# EAGLE design SparkFun_ZOE-M8Q GPS (EAGLE 9.6.2)
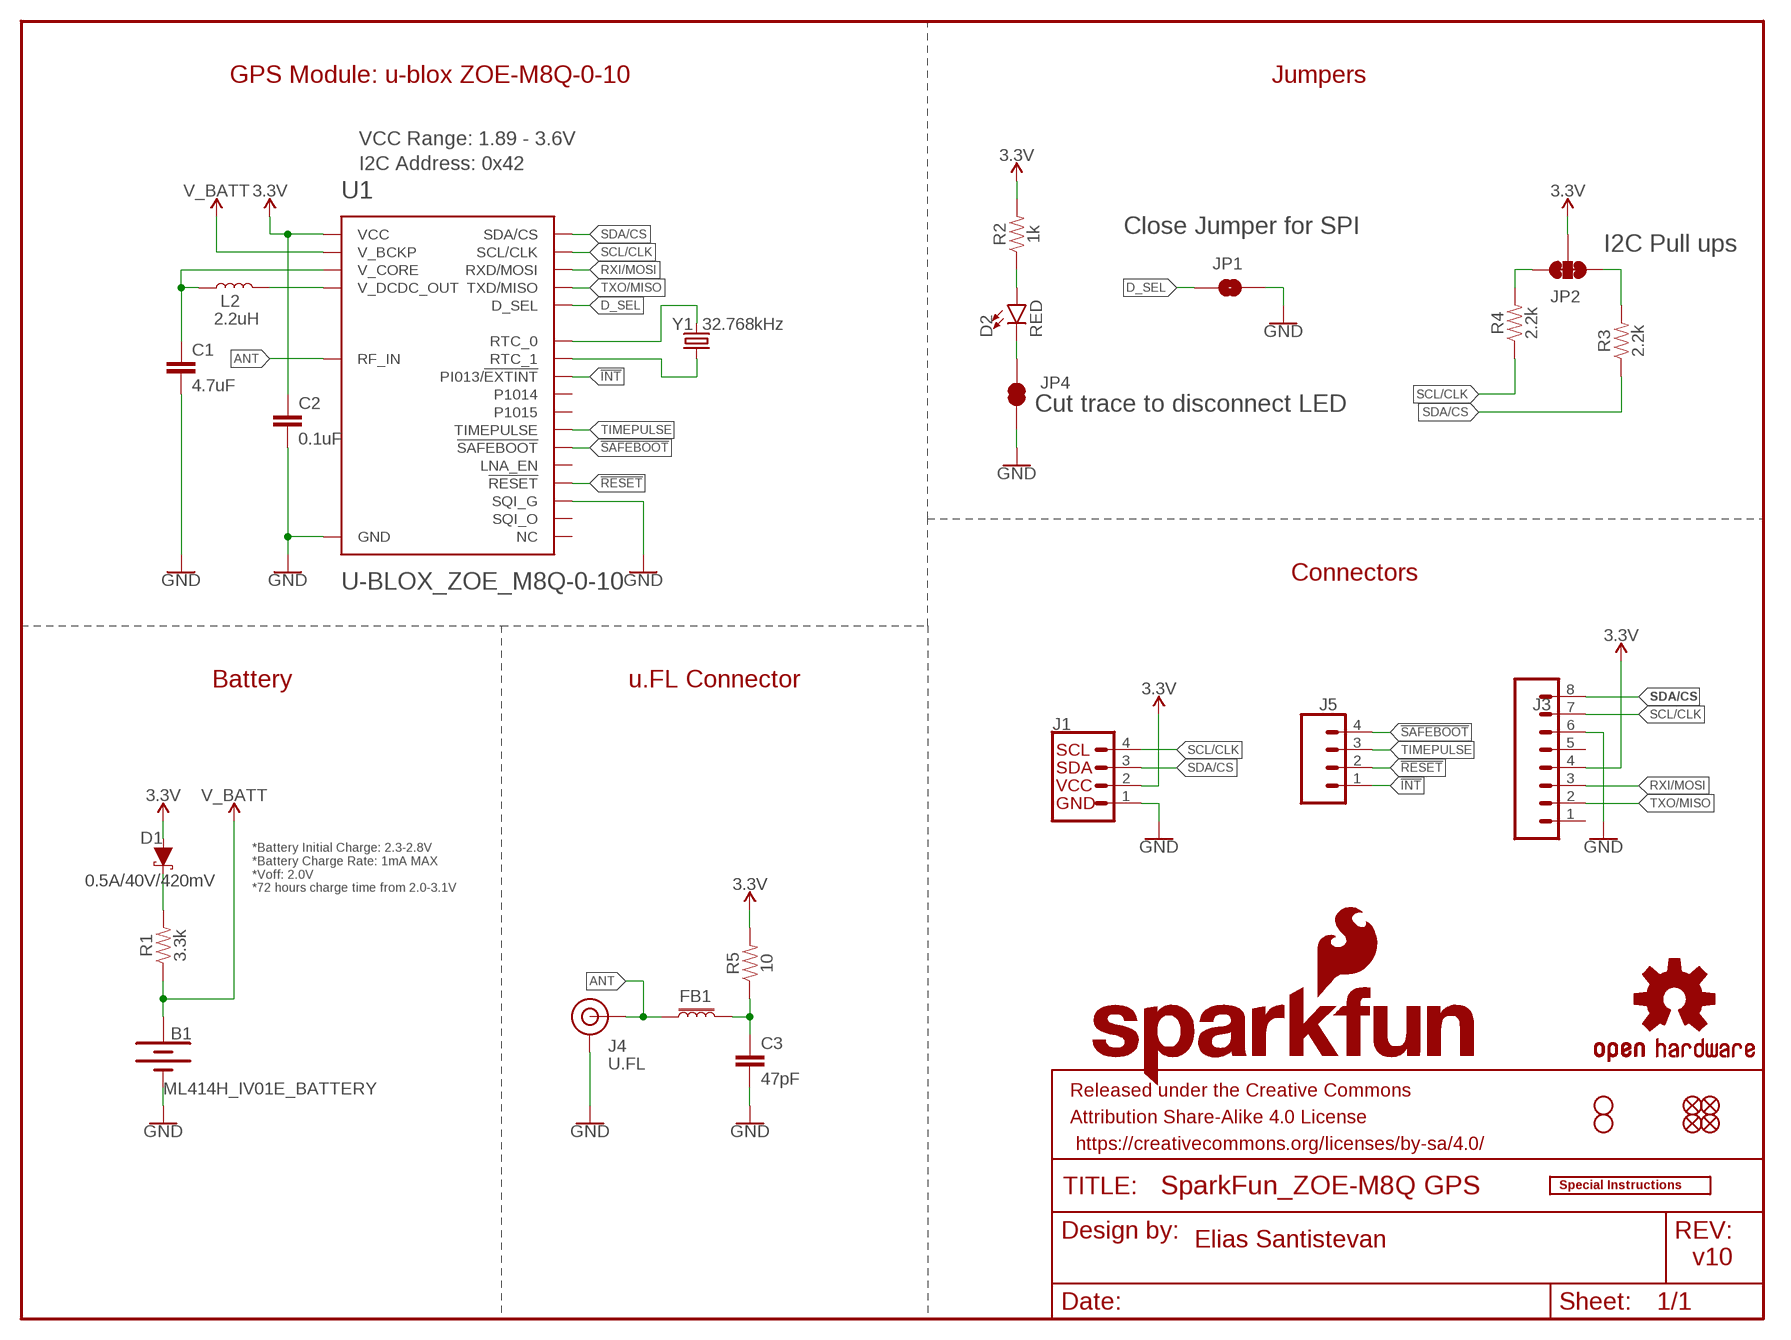
[diagram p0: schematic, sheet 1]

## Parts
B1  ML414H_IV01E_BATTERY  [ML414H_IV01E]
C1  4.7uF  4.7UF-0603-6.3V-(10%)  [0603]
C2  0.1uF  0.1UF-0603-25V-(+80/-20%)  [0603]
C3  47pF  47PF-0603-50V-5%  [0603]
D1  0.5A/40V/420mV  DIODE-SCHOTTKY-PMEG4005EJ  [SOD-323]
D2  RED  LED-RED0603  [LED-0603]
FB1  FERRITE_BEAD-120_OHM-0402  [0402]
FD1  FIDUCIALUFIDUCIAL  [FIDUCIAL-MICRO]
FD2  FIDUCIALUFIDUCIAL  [FIDUCIAL-MICRO]
FD3  FIDUCIALUFIDUCIAL  [FIDUCIAL-MICRO]
FD4  FIDUCIALUFIDUCIAL  [FIDUCIAL-MICRO]
FRAME1  FRAME-LETTER  [CREATIVE_COMMONS]
H2  STAND-OFFTIGHT  [STAND-OFF-TIGHT]
H3  STAND-OFFTIGHT  [STAND-OFF-TIGHT]
J1  QWIIC_CONNECTORJS-1MM  [JST04_1MM_RA]
J3  CONN_08NO_SILK_FEMALE_PTH  [1X08_NO_SILK]
J4  U.FL  U.FL2PIN  [U.FL]
J5  CONN_041X04_NO_SILK  [1X04_NO_SILK]
JP1  JUMPER-SMT_2_NO_SILK  [SMT-JUMPER_2_NO_SILK]
JP2  JUMPER-SMT_3_2-NC_TRACE_SILK  [SMT-JUMPER_3_2-NC_TRACE_SILK]
JP4  JUMPER-SMT_2_NC_TRACE_SILK  [SMT-JUMPER_2_NC_TRACE_SILK]
L2  2.2uH  2.2μH_SHIELDED_INDUCTOR  [0806]
LOGO1  SFE_LOGO_NAME_FLAME.1_INCH  [SFE_LOGO_NAME_FLAME_.1]
LOGO2  OSHW-LOGOS  [OSHW-LOGO-S]
LOGO3  SFE_LOGO_FLAME.1_INCH  [SFE_LOGO_FLAME_.1]
LOGO4  SPECIAL_INSTRUCTIONS-ORDERING  [ORDERING_INSTRUCTIONS]
R1  3.3k  3.3KOHM-0603-1/10W-1%  [0603]
R2  1k  1KOHM-0603-1/10W-1%  [0603]
R3  2.2k  2.2KOHM-0603-1/10W-1%  [0603]
R4  2.2k  2.2KOHM-0603-1/10W-1%  [0603]
R5  10  10OHM-0603-1/10W-1%  [0603]
U1  U-BLOX_ZOE_M8Q-0-10  [UBLOX_ZOE_M8-0-10]
Y1  32.768kHz  CRYSTAL-32.768KHZSMD-3.2X1.5  [CRYSTAL-SMD-3.2X1.5MM]

## Nets
3.3V: C2.1 D1.A J1.2 J3.4 JP2.2 R2.2 R5.2 U1.24(VCC) U1.25(VCC)
!INT: J5.1 U1.43(PI013/!EXTINT)
!RESET: J5.2 U1.20(!RESET)
!SAFEBOOT: J5.4 U1.34(!SAFEBOOT)
ANT: FB1.1 J4.FEED(SIGNAL) U1.4(RF_IN)
D_SEL: JP1.1 U1.48(D_SEL)
GND: B1.- C1.2 C2.2 C3.2 J1.1 J3.6 J4.1(GND) J4.2(GND) JP1.2 JP4.1 U1.1(GND) U1.3(GND) U1.5(GND) U1.7(GND) U1.8(GND) U1.9(GND) U1.10(GND) U1.11(GND) U1.12(GND) U1.17(GND) U1.23(GND) U1.29(SQI_G) U1.31(SQI_G) U1.37(GND) U1.38(GND) U1.39(GND) U1.40(GND) U1.41(GND) U1.44(GND) U1.46(SQI_G) U1.47(SQI_G) U1.49(GND)
N$1: JP2.1 R3.2
N$2: D1.C R1.2
N$3: JP2.3 R4.2
N$4: D2.A R2.1
N$6: C1.1 L2.1 U1.27(V_CORE)
N$7: L2.2 U1.26(V_DCDC_OUT)
N$8: D2.C JP4.2
N$9: C3.1 FB1.2 R5.1
N$13: U1.18(RTC_0) Y1.P$2
N$15: U1.19(RTC_1) Y1.P$1
RXI/MOSI: J3.3 U1.22(RXD/MOSI)
SCL/CLK: J1.4 J3.7 R4.1 U1.32(SCL/CLK)
SDA/CS: J1.3 J3.8 R3.1 U1.2(SDA/CS)
TIMEPULSE: J5.3 U1.33(TIMEPULSE)
TXO/MISO: J3.2 U1.21(TXD/MISO)
V_BATT: B1.+ R1.1 U1.16(V_BCKP)
Unconnected: J3.1 J3.5 U1.6(NC) U1.13(NC) U1.14(NC) U1.15(NC) U1.28(NC) U1.30(SQI_O) U1.35(LNA_EN) U1.36(P1015) U1.42(NC) U1.45(SQI_O) U1.50(P1014) U1.51(NC)

## Notes on the sheet
- GPS Module: u-blox ZOE-M8Q-0-10 | Jumpers
- VCC Range: 1.89 - 3.6V
- I2C Address: 0x42
- Close Jumper for SPI
- I2C Pull ups
- Cut trace to disconnect LED
- Connectors
- Battery | u.FL Connector
- *Battery Initial Charge: 2.3-2.8V
  *Battery Charge Rate: 1mA MAX
  *Voff: 2.0V
  *72 hours charge time from 2.0-3.1V
- Elias Santistevan
- v10

## Library data of the parts
B1 = SparkFun-Batteries:ML414H_IV01E_BATTERY: SEIKO ML414H-IV01E Reflowable Lithium Battery ML414H is a rechargeable, coin type battery with features such as Pb-free reflowable (Peak temperature: 260 C) and high temperature heat resistance. Battery Characteristics: 3.1V max voltage Voff is 2V 1mAH 3k series resistor with battery 72 hour charge time from 2.0-3.1V 2.3-2.8V initial charge; PROD_ID: BATT-14267
C1 = SparkFun-Capacitors:4.7UF: 4.7µF ceramic capacitors A capacitor is a passive two-terminal electrical component used to store electrical energy temporarily in an electric field.; PROD_ID: CAP-08280
C2 = SparkFun-Capacitors:0.1UF: 0.1µF ceramic capacitors A capacitor is a passive two-terminal electrical component used to store electrical energy temporarily in an electric field.; PROD_ID: CAP-00810
C3 = SparkFun-Capacitors:47PF: 47pF ceramic capacitors A capacitor is a passive two-terminal electrical component used to store electrical energy temporarily in an electric field.; PROD_ID: CAP-08913
D1 = SparkFun-DiscreteSemi:DIODE-SCHOTTKY: Schottky diode A Schottky diode is a semiconductor diode which has a low forward voltage drop and a very fast switching action.; PROD_ID: DIO-10955
D2 = SparkFun-LED:LED-RED: Red SMD LED Used in manufacturing of most products at SparkFun Packages: 0603 - SMD 0603 package [Product Link] <http://docs.avagotech.com/docs/AV02-0551EN> 0603 SMART - SMD 0603 SMART package ( more efficient and expensive)[Product Link] <http://www.osram-os.com/Graphics/XPic2/00077099_0.pdf> 1206 - SMD1206 package [Product Link] <https://www.sparkfun.com/datasheets/DevTools/LilyPad/Q150OVS4.pdff> SparkFun Products: Pro Mini 328 -5V <https://www.sparkfun.com/products/821> RedBoard <https://www.sparkfun.com/products/12757> IOIO-OTG <https://www.sparkfun.com/products/13613>; PROD_ID: DIO-00819
FB1 = SparkFun-Coils:FERRITE_BEAD-120_OHM: Ferrite Bead (blocks, cores, rings, chokes, etc.) Inductor with layers of ferrite used to suppress high frequencies. Often used to isolate high frequency noise.; MFG_PART: BLM15HB121SN1D; PROD_ID: NDUC-14206
FD1-FD4 = SparkFun-Aesthetics:FIDUCIAL: Fiducial Alignment Points Point-of-reference for pick-and-place machines and other optical instruments.
FRAME1 = SparkFun-Aesthetics:FRAME-LETTER: Schematic Frame - Letter Standard 8.5x11 US Letter frame
H2 H3 = SparkFun-Hardware:STAND-OFF: Stand Off Drill holes for mechanically mounting via screws, standoffs, etc. Note: Use the keepout ring to avoid running the screw head into surrounding components. Variant Overviews STAND-OFF - Mechanical footprint for a #4 phillips button head screw. STAND-OFF-TIGHT - Mechanical footprint for a #4 phillips button head screw, Example SparkFun Products Screw - Phillips Head (1/4", 4-40, 10 pack) <https://www.sparkfun.com/products/10453> (PRT-10453) Screw - Phillips Head (1/2", 4-40, 10 pack) <https://www.sparkfun.com/products/10452> (PRT-10452) Screw - Phillips Head (3/4", 4-40, 10 pack) <https://www.sparkfun.com/products/10451> (PRT-10451) Screw - Phillips Head (1", 4-40, 10 pack) <https://www.sparkfun.com/products/10450> (PRT-10450)
J1 = SparkFun-Connectors:QWIIC_CONNECTOR: SparkFun I2C Standard Qwiic Connector An SMD 1mm pitch JST connector makes it easy and quick (get it? Qwiic?) to connect I2C devices to each other. The Qwiic system <http://www.sparkfun.com/qwiic> enables fast and solderless connection between popular platforms and various sensors and actuators. We carry 200mm <https://www.sparkfun.com/products/14204>, 100mm <https://www.sparkfun.com/products/14205>, 50mm <https://www.sparkfun.com/products/14206>, and breadboard friendly <https://www.sparkfun.com/products/14207> Qwiic cables. We also offer 10 pcs strips <https://www.sparkfun.com/products/14323> the SMD connectors.; PROD_ID: CONN-13694
J3 = SparkFun-Connectors:CONN_08: Multi connection point. Often used as Generic Header-pin footprint for 0.1 inch spaced/style header connections On any of the 0.1 inch spaced packages, you can populate with these: Break Away Headers - Straight <https://www.sparkfun.com/products/116> (PRT-00116) Break Away Male Headers - Right Angle <https://www.sparkfun.com/products/553> (PRT-00553) Female Headers <https://www.sparkfun.com/products/115> (PRT-00115) Break Away Headers - Machine Pin <https://www.sparkfun.com/products/117> (PRT-00117) Break Away Female Headers - Swiss Machine Pin <https://www.sparkfun.com/products/743> (PRT-00743) Arduino Stackable Header - 8 Pin <https://www.sparkfun.com/products/9279> (PRT-09279) For SCREWTERMINALS and SPRING TERMINALS visit here: Screw Terimnals on SparkFun.com <https://www.sparkfun.com/search/results?term=Screw+Terminals> (5mm/3.5mm/2.54mm spacing) This device is also useful as a general connection point to wire up your design to another part of your project. Our various solder wires solder well into these plated through hole pads. Hook-Up Wire - Assortment (Stranded, 22 AWG) <https://www.sparkfun.com/products/11375> (PRT-11375) Hook-Up Wire - Assortment (Solid Core, 22 AWG) <https://www.sparkfun.com/products/11367> (PRT-11367) View the entire wire category on our website here <https://www.sparkfun.com/categories/141> Special notes: Molex polarized connector foot print use with SKU : PRT-08231 with associated crimp pins and housings. 1MM SMD Version SKU: PRT-10208 NOTES ON THE VARIANTS LOCK and LOCK_LONGPADS... This footprint was designed to help hold the alignment of a through-hole component (i.e. 6-pin header) while soldering it into place. You may notice that each hole has been shifted either up or down by 0.005 of an inch from it's more standard position (which is a perfectly straight line). This slight alteration caused the pins (the squares in the middle) to touch the edges of the holes. Because they are alternating, it causes a "brace" to hold the component in place. 0.005 has proven to be the perfect amount of "off-center" position when using our standard breakaway headers. Although looks a little odd when you look at the bare footprint, once you have a header in there, the alteration is very hard to notice. Also,if you push a header all the way into place, it is covered up entirely on the bottom side.; PROD_ID: CONN-08438
J4 = SparkFun-Connectors:U.FL2PIN: SMD Antenna Connector - U.FL 2mm height, 3.0mm x 3.0mm receptacle size. SparkFun Products: SparkFun WiFi Shield - ESP8266 <https://www.sparkfun.com/products/13287> SparkFun ESP8266 Thing <https://www.sparkfun.com/products/13231> SparkFun MiniGen - Pro Mini Signal Generator Shield <https://www.sparkfun.com/products/11420>; PROD_ID: CONN-09193; SF_ID: WRL-09144
J5 = SparkFun-Connectors:CONN_04: Multi connection point. Often used as Generic Header-pin footprint for 0.1 inch spaced/style header connections On any of the 0.1 inch spaced packages, you can populate with these: Break Away Headers - Straight <https://www.sparkfun.com/products/116> (PRT-00116) Break Away Male Headers - Right Angle <https://www.sparkfun.com/products/553> (PRT-00553) Female Headers <https://www.sparkfun.com/products/115> (PRT-00115) Break Away Headers - Machine Pin <https://www.sparkfun.com/products/117> (PRT-00117) Break Away Female Headers - Swiss Machine Pin <https://www.sparkfun.com/products/743> (PRT-00743) For SCREWTERMINALS and SPRING TERMINALS visit here: Screw Terimnals on SparkFun.com <https://www.sparkfun.com/search/results?term=Screw+Terminals> (5mm/3.5mm/2.54mm spacing) This device is also useful as a general connection point to wire up your design to another part of your project. Our various solder wires solder well into these plated through hole pads. Hook-Up Wire - Assortment (Stranded, 22 AWG) <https://www.sparkfun.com/products/11375> (PRT-11375) Hook-Up Wire - Assortment (Solid Core, 22 AWG) <https://www.sparkfun.com/products/11367> (PRT-11367) View the entire wire category on our website here <https://www.sparkfun.com/categories/141> Special notes: Molex polarized connector foot print use with SKU : PRT-08231 with associated crimp pins and housings. 1MM SMD Version SKU: PRT-10208; PROD_ID: CONN-09696
JP1 = SparkFun-Jumpers:JUMPER-SMT_2_NO: Normally open jumper This jumper has two pads in close proximity to each other. Apply solder to close the connection. Round pads are easier to solder for beginners, but are a lot larger. SparkFun Product that uses the round pads: SparkFun EL Sequencer <https://www.sparkfun.com/products/12781>
JP2 = SparkFun-Jumpers:JUMPER-SMT_3_2-NC_TRACE: Normally closed trace jumper (2 of 2 connections) This jumper has a trace between all three pads so they are normally closed (NC). Use a razor knife to open the connection(s). For best results follow the IPC guidelines for cutting traces: Cutout at least 0.063 mm (0.005 in). Remove all loose material to clean up the cut area. Seal the cut with an approved epoxy. Reapply solder to reclose the connection(s).
JP4 = SparkFun-Jumpers:JUMPER-SMT_2_NC_TRACE: Normally closed trace jumper This jumper has a trace between two pads so it's normally closed (NC). Use a razor knife to open the connection. For best results follow the IPC guidelines for cutting traces: Cutout at least 0.063 mm (0.005 in). Remove all loose material to clean up the cut area. Seal the cut with an approved epoxy. Reapply solder to reclose the connection.
L2 = SparkFun-Coils:2.2μH_SHIELDED_INDUCTOR: Murata 2.2uH Inductor 2.2uH 1.2A 110mOhm 0806 Package Shielded; PROD_ID: NDUC-14257
LOGO1 = SparkFun-Aesthetics:SFE_LOGO_NAME_FLAME: SparkFun Font Logo w/ Flame This is the SparkFun full logo. The logo on the schematic will always be the same size; the package variant is the height of the flame part of the logo. Default layer for the logo on the board is tSilk.
LOGO2 = SparkFun-Aesthetics:OSHW-LOGO: Open-Source Hardware (OSHW) Logo This logo indicates the piece of hardware it is found on incorporates a OSHW license and/or adheres to the definition of open source hardware found here: http://freedomdefined.org/OSHW
LOGO3 = SparkFun-Aesthetics:SFE_LOGO_FLAME: SparkFun Flame Logo This is the SparkFun flame logo. The logo on the schematic will always be the same size; the package variant is the height of the flame. Default layer for the logo on the board is tSilk.
LOGO4 = SparkFun-Aesthetics:SPECIAL_INSTRUCTIONS: Special Ordering/Production Instructions Alert Symbol for special PCB ordering instructions or unique production process warnings. Ordering Instructions Production Instructions Types of information that should be added to box: Copper weight Soldermask color Silk color PCB thickness Number of layers PCB Standard: 1.6mm FR4 1 oz copper immersion silver plating red soldermask white silkscreen Types of information that should be added to box: Special wash requirements Depaneling instructions Humidification Glue curing Default text settings: 0.07 inch 9% ratio 50% line distance
R1 = SparkFun-Resistors:3.3KOHM: 3.3kΩ resistor A resistor is a passive two-terminal electrical component that implements electrical resistance as a circuit element. Resistors act to reduce current flow, and, at the same time, act to lower voltage levels within circuits. - Wikipedia; PROD_ID: RES-07851
R2 = SparkFun-Resistors:1KOHM: 1kΩ resistor A resistor is a passive two-terminal electrical component that implements electrical resistance as a circuit element. Resistors act to reduce current flow, and, at the same time, act to lower voltage levels within circuits. - Wikipedia; PROD_ID: RES-07856
R3 R4 = SparkFun-Resistors:2.2KOHM: 2.2kΩ resistor A resistor is a passive two-terminal electrical component that implements electrical resistance as a circuit element. Resistors act to reduce current flow, and, at the same time, act to lower voltage levels within circuits. - Wikipedia; PROD_ID: RES-08272
R5 = SparkFun-Resistors:10OHM: 10Ω resistor A resistor is a passive two-terminal electrical component that implements electrical resistance as a circuit element. Resistors act to reduce current flow, and, at the same time, act to lower voltage levels within circuits. - Wikipedia; PROD_ID: RES-12581
U1 = SparkFun-GPS:U-BLOX_ZOE_M8Q-0-10: UBLOX ZOE-M8Q-0-10 u-blox ZOE-M8 standard precision GNSS SiP (System in Package) modules feature the high performance u-blox M8 GNSS engine. ZOE-M8’s ultra-miniature form factor integrates a complete GNSS receiver including SAW filter, LNA and TCXO. Handles all GNSS systems and can simulatenously use up to three of them, with accuracy ranging from 2.5m to 4m. GPS GLONASS BeiDou Galileo This can be corrected with the SBAS or QZSS augmentation systems.; PROD_ID: IC-14251
Y1 = SparkFun-Clocks:CRYSTAL-32.768KHZ: 32.768kHz Crystal Frequency: 32.768kHz Frequency Stability: ±20ppm Load Capacitance: 12.5pF (PTH-2X6 & SMD-3.2X1.5), 6pF (SMD-2X6) SparkFun Products: SparkFun BigTime Watch Kit <https://www.sparkfun.com/products/11734> SparkFun nRF52832 Breakout <https://www.sparkfun.com/products/13990> SparkFun Real Time Clock Module <https://www.sparkfun.com/products/12708>; PROD_ID: XTAL-13062

## Board
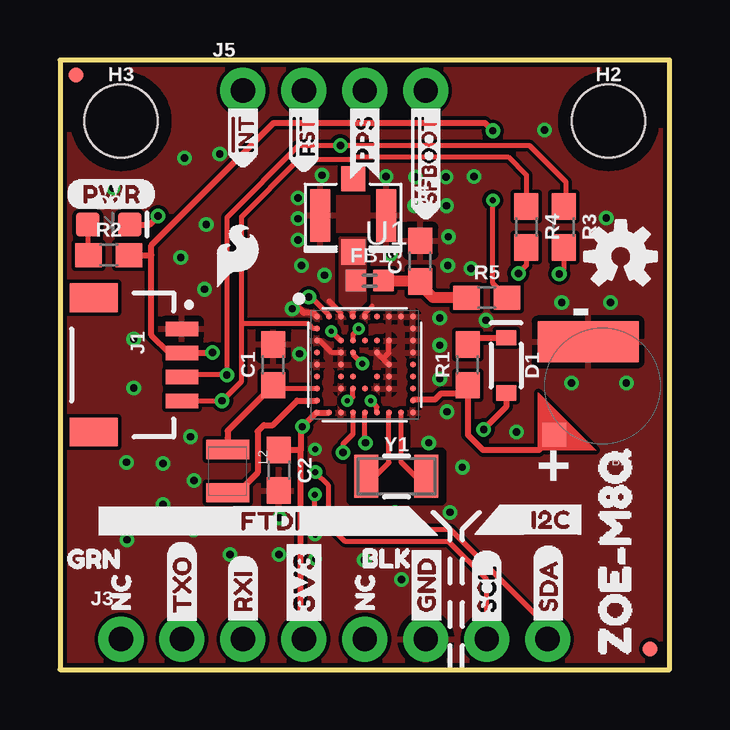
[diagram p1: board, top side]
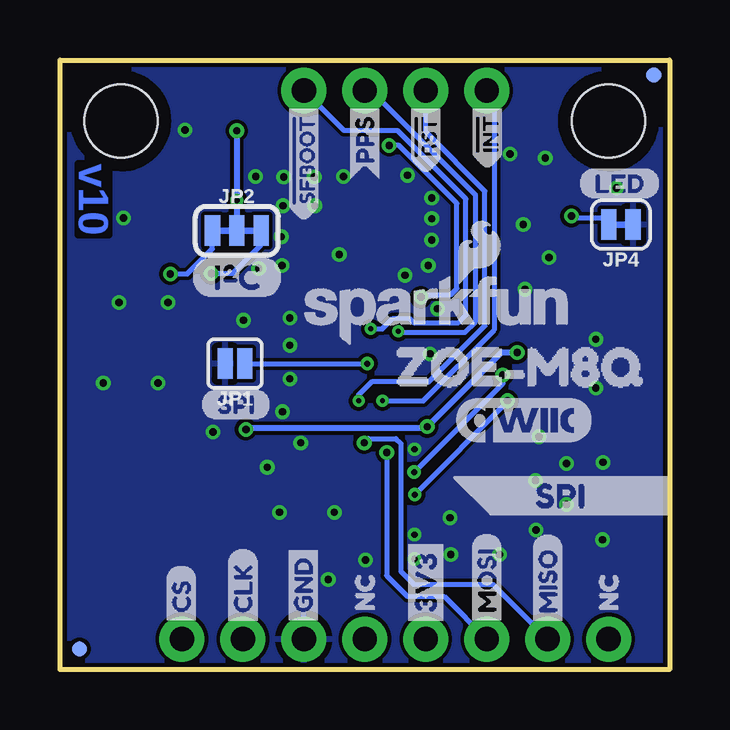
[diagram p2: board, bottom side, seen from below]

Size 25.4 x 25.4 mm. Coordinates in mm from the lower left corner, seen from the top.
Outline: 0,0 25.4,0 25.4,25.4 0,25.4 0,0
Copper layers (1*16): Top 0.035mm / dielectric 1.5mm / Bottom 0.035mm
Design rules "SparkFun-2-layer-TIGHT *": minimum track width 7mil, minimum drill 15mil, track to track 6mil, track to pad 6mil, pad to pad 6mil, via to via 6mil, smd to smd 6mil, copper to edge 7mil, drill to drill 7mil, minimum pad ring 7mil, minimum via ring 6mil, stop-mask expansion 4mil, vias tented up to drill 25mil, thermal gap 10mil
tRestrict: 7 lines

### Footprints (pad centres in the part's own frame; a part is rotated, then mirrored left to right if it is on the bottom)
ML414H_IV01E = smd 1 x 1: + 2.022,2.032 | smd 4.2 x 1.7: - 0.6,-1.85
0603 = smd 1.1 x 1: 1 -0.85,0; 2 0.85,0
SOD-323 = smd 0.63 x 0.83: A 1.15,0; C -1.15,0
LED-0603 = smd 1 x 1: A -0.877,0; C 0.877,0
0402 = smd 0.85 x 0.9: 1 -0.58,0; 2 0.58,0
FIDUCIAL-MICRO = smd 0.635 x 0.635: 1 0,0
STAND-OFF-TIGHT = hole 3.048: 0,0
JST04_1MM_RA = smd 0.6 x 1.35: 1 -1.5,0; 2 -0.5,0; 3 0.5,0; 4 1.5,0 | smd 1.2 x 2: NC1 2.8,-3.675; NC2 -2.8,-3.675
1X08_NO_SILK = drill 1.016 pad 1.88: 1 0,0; 2 2.54,0; 3 5.08,0; 4 7.62,0; 5 10.16,0; 6 12.7,0; 7 15.24,0; 8 17.78,0
U.FL = smd 2.2 x 0.85: 1 0,1.375; 2 0,-1.375 | smd 1.05 x 1: FEED 1.525,0; NC -1.525,0
1X04_NO_SILK = drill 1.016 pad 1.88: 1 0,0; 2 2.54,0; 3 5.08,0; 4 7.62,0
SMT-JUMPER_2_NO_SILK = smd 0.635 x 1.27: 1 -0.406,0; 2 0.406,0
SMT-JUMPER_3_2-NC_TRACE_SILK = smd 0.635 x 1.27: 1 -1.016,0; 2 0,0; 3 1.016,0
SMT-JUMPER_2_NC_TRACE_SILK = smd 0.635 x 1.27: 1 -0.508,0; 2 0.508,0
0806 = smd 0.8 x 1.8: 1 -1.3,0; 2 0.5,0
UBLOX_ZOE_M8-0-10 = smd 0.25 x 0.25: 1 -1.996,2.004; 2 -1.496,2.004; 3 -0.996,2.004; 4 -0.496,2.004; 5 0.004,2.004; 6 0.504,2.004; 7 1.004,2.004; 8 1.504,2.004; 9 2.004,2.004; 10 2.004,1.504; 11 2.004,1.004; 12 2.004,0.504; 13 2.004,0.004; 14 2.004,-0.496; 15 2.004,-0.996; 16 2.004,-1.496; 17 2.004,-1.996; 18 1.504,-1.996; 19 1.004,-1.996; 20 0.504,-1.996; 21 0.004,-1.996; 22 -0.496,-1.996; 23 -0.996,-1.996; 24 -1.496,-1.996; 25 -1.996,-1.996; 26 -1.996,-1.496; 27 -1.996,-0.996; 28 -1.996,-0.496; 29 -1.996,0.004; 30 -1.996,0.504; 31 -1.996,1.004; 32 -1.996,1.504; 33 -0.996,1.004; 34 -0.496,1.004; 35 0.004,1.004; 36 0.504,1.004; 37 1.004,1.004; 38 1.004,0.004; 39 1.004,-0.496; 40 1.004,-0.996; 41 0.504,-0.996; 42 0.004,-0.996; 43 -0.496,-0.996; 44 -0.996,-0.996; 45 -0.996,-0.496; 46 -0.996,0.004; 47 -0.996,0.504; 48 -0.496,0.504; 49 0.504,0.504; 50 0.504,-0.496; 51 -0.496,-0.496
CRYSTAL-SMD-3.2X1.5MM = smd 1 x 1.8: P$1 -1.25,0; P$2 1.25,0

### Placement (x,y rotation side)
B1  22.61,11.81 180 top
C1  8.89,12.7 90 top
C2  9.12,8.31 270 top
C3  15.01,17.02 90 top
D1  18.59,12.67 270 top
D2  2.03,18.54 0 top
FB1  12.9,16.21 0 top
FD1  0.66,24.77 0 top
FD2  24.59,0.86 0 bottom
FD3  0.66,24.77 0 bottom
FD4  24.59,0.86 0 top
FRAME1  -7.87,-12.7 0 top  (outside the outline)
H2  22.86,22.86 0 top
H3  2.54,22.86 0 top
J1  5.08,12.7 270 top
J3  2.54,1.27 0 top
J4  12.22,18.92 270 top
J5  7.62,24.13 0 top
JP1  18.11,12.75 180 bottom
JP2  18.03,18.29 0 bottom
JP4  2.03,18.54 180 bottom
L2  6.99,7.87 270 top
LOGO1  9.65,14.99 0 bottom
LOGO2  23.36,17.21 0 top
LOGO3  7.39,17.26 0 top
LOGO4  -27.94,-18.29 0 top  (outside the outline)
R1  16.99,12.7 90 top
R2  2.03,17.27 0 top
R3  20.98,18.44 270 top
R4  19.43,18.44 270 top
R5  17.78,15.49 0 top
U1  12.7,12.7 0 top
U$1  [3V3-03]  10.16,1.57 90 top
U$2  [SDA0]  20.35,1.7 90 top
U$3  [SCL0]  17.78,1.68 90 top
U$4  [GND0]  15.27,1.7 90 top
U$5  [CS0]  20.35,1.68 90 bottom
U$6  [MISO0]  5.08,1.65 90 bottom
U$7  [GND0]  15.27,1.7 90 bottom
U$8  [CLK0]  17.78,1.68 90 bottom
U$9  [SPI0]  6.49,7.24 0 bottom
U$10  [3V3-03]  10.16,1.57 90 bottom
U$11  [#INT0]  7.62,20.73 90 top
U$12  [#RST0]  10.16,20.57 90 top
U$13  [PPS0]  12.7,20.4 90 bottom
U$14  [#SFBOOT0]  15.24,18.59 90 top
U$15  [TXO0]  5.08,1.65 90 top
U$16  [ZOE#M8Q0]  12.75,12.62 0 bottom
U$17  [SPI0]  19.52,11.04 0 bottom
U$18  [#INT0]  7.59,20.73 90 bottom
U$19  [RXI0]  7.62,1.7 90 top
U$20  [BLK0]  11.9,4.64 0 top
U$21  [#RST0]  10.16,20.57 90 bottom
U$22  [NC0]  12.7,1.78 90 top
U$23  [PPS0]  12.7,20.4 90 top
U$24  [#SFBOOT0]  15.24,18.59 90 bottom
U$25  [LED0]  3.81,20.26 0 bottom
U$26  [PWR-()-03]  0.25,19.81 0 top
U$27  [MOSI0]  7.62,1.68 90 bottom
U$28  [FTDI0]  6.83,6.2 0 top
U$29  [I2C0]  18.92,6.25 0 top
U$30  [ZOE#M8Q0]  23.11,-0.51 90 top
U$31  [GRN0]  -0.38,4.62 0 top
U$32  [I_SUPER2_C-()-04]  19.92,16.35 0 bottom
U$33  [NC0]  2.54,1.78 90 top
U$34  [NC0]  12.7,1.78 90 bottom
U$35  [NC0]  2.54,1.78 90 bottom
U$36  [QWIIC_COPYRIGHT_SMALL]  6.1,10.41 0 bottom
Y1  14.02,8.05 0 top

### Tracks (layer width: path | path; a pad name or v marks a point on that pad's centre or on a via)
3.3V  (via drill 0.25, 0.3)
  Top 0.203: R5.2 18.03,16.09 v18.03,19.56
  Top 0.254: U1.24 U1.25 10.68,10.7 v10.1,10.12 10.03,10.06 10.03,9.14 | v6.35,13.21 J1.2 4.55,13.2 3.81,13.94 3.81,17.27 | D1.A 18.59,10.95 v17.65,10.01 | v18.03,22.45 17.7,22.78 8.91,22.78 3.81,17.68 3.81,17.27 | R2.2 3.81,17.27 | 10.03,9.14 10.03,1.4 J3.4 | 10.03,9.14 9.13,9.14 C2.1
  Bottom 0.254: v6.35,13.21 7.01,13.21 v10.1,10.12 10.16,10.06 17.6,10.06 v17.65,10.01 | v18.03,22.45 v18.03,19.56 JP2.2
!INT  (via drill 0.2)
  Top 0.203: v11.96,11.2 12.04,11.2 12.2,11.37 U1.43
  Bottom 0.203: v11.96,11.2 10.26,11.2 7.32,14.15 7.32,23.82 J5.1
!RESET  (via drill 0.2)
  Top 0.203: U1.20 13.2,10.95 v12.95,11.2
  Bottom 0.203: v12.95,11.2 12.95,11.46 12.42,11.99 10.03,11.99 7.7,14.33 7.7,19.94 10.16,22.4 J5.2
!SAFEBOOT  (via drill 0.2)
  Top 0.203: v12.45,14.2 12.2,13.96 U1.34
  Bottom 0.203: J5.4 13.56,22.45 11.33,22.45 8.48,19.61 8.48,14.76 8.79,14.45 10.67,14.45 10.85,14.63 11.53,14.63 11.96,14.2 v12.45,14.2
ANT
  Top 0.254: U1.4 12.2,14.95
  pour Top (isolate 0.152, no thermals): 11.68,17.14 11.68,15.29 12.09,14.88 12.24,14.88 12.73,15.37 12.73,17.98 11.71,17.98 11.68,17.98
D_SEL  (via drill 0.25)
  Top 0.203: U1.48 12.2,13.14 v12.6,12.75
  Bottom 0.203: JP1.1 v12.6,12.75
GND  (via drill 0.25 pad 0.25, 0.3)
  Top 0.203: U1.47 11.33,13.2 10.83,13.7 U1.31 | U1.49 13.46,12.95 | 13.46,12.95 U1.38 | 13.46,12.95 13.7,13.2 U1.37 | U1.3 11.7,14.86 11.21,15.36 | U1.5 12.7,14.85 13,15.14
  Top 0.254: U1.1 10.55,14.86 10.16,14.86 9.98,15.04 v9.68,15.04
  other vias: 22.94,15.29 20.19,22.48 4.29,6.88 6.1,18.54 5.18,21.31 22.76,18.82 2.77,8.64 15.37,9.45 5.44,9.7 11.02,16.43 9.91,17.9 9.91,19.65 10.92,20.6 13.59,20.55 14.78,19.33 16.1,19.33 16.08,20.52 14.81,20.52 10.06,16.84 9.91,18.79 17.25,20.55 16.18,18.03 16.15,16.84 17.12,16.71 5.59,7.87 4.29,8.59 5.03,17.17 6.02,15.85 6.65,21.49 2.21,20.07 16.76,8.43 3.07,11.73 2.79,5.41 15.82,13.51 15.82,12.12 15.82,14.66 9.98,13.16 9.14,6.32 9.12,4.8 5.56,5.82 21.31,11.94 23.6,11.94 12.67,4.57 3.07,13.77 7.09,4.8 16.13,10.74 20.9,15.29 19.02,9.91 17.75,14.55 13.97,6.55 14.22,3.76 10.63,9.18 10.63,5.63 10.63,4.61 16.26,6.55 13.77,17.3
  pour Top (isolate 0.152, rank 4): 0,25.4 0,0 25.4,0 25.4,25.4
  pour Bottom (isolate 0.152, rank 4): 0,25.4 0,0 25.4,0 25.4,25.4
N$1  (via drill 0.3)
  Top 0.203: R3.2 20.98,16.66 v20.8,16.48
  Bottom 0.203: v20.8,16.48 20.09,16.48 19.05,17.53 JP2.1
N$2
  Top 0.254: D1.C 18.57,13.8 17.25,13.8 R1.2
N$3  (via drill 0.3)
  Top 0.203: R4.2 19.43,16.84 v19.1,16.51
  Bottom 0.203: v19.1,16.51 18.21,16.51 17.02,17.7 JP2.3
N$4
  Top 0.203: D2.A 1.16,17.3 R2.1
N$6
  Top 0.203: C1.1 9.08,11.66 9.12,11.7 U1.27
  Top 0.254: C1.1 6.99,9.95 6.99,9.65 L2.1
N$7
  Top 0.254: U1.26 9.88,11.2 8.87,10.19 8.49,10.19 8.23,9.93 8.23,8.2 7.4,7.37 L2.2
N$8  (via drill 0.3)
  Top 0.254: D2.C 3.73,18.54 v4.09,18.9
  Bottom 0.203: v4.09,18.9 3.99,18.8 2.79,18.8 JP4.2
N$9
  Top 0.457: FB1.2 14.83,16.2 15.01,16.03 | 15.01,16.03 C3.1 | R5.1 15.54,15.49 15.01,16.03
N$13
  Top 0.203: Y1.P$2 14.81,8.05 14.2,8.66 U1.18
N$15
  Top 0.203: Y1.P$1 13.13,8.05 13.7,8.62 U1.19
RXI/MOSI  (via drill 0.3)
  Top 0.203: U1.22 12.2,9.82 11.79,9.4 v11.79,9.04
  Bottom 0.203: v11.79,9.04 11.79,3.91 10.92,3.05 9.4,3.05 J3.3
SCL/CLK  (via drill 0.25, 0.3)
  Top 0.203: 7.57,14.35 7.57,12.01 v6.75,11.2 J1.4 | 7.57,14.35 7.57,18.87 9.96,21.26 12.14,21.26 12.24,21.36 18.67,21.36 19.43,20.6 R4.1 | U1.32 10.56,14.2 10.36,14.4 7.62,14.4 7.57,14.35 | J3.7 17.78,3.76 16.2,5.33 11.89,5.33 10.62,6.61 v10.62,7.29
  Bottom 0.203: v10.62,7.29 6.75,11.15 v6.75,11.2
SDA/CS  (via drill 0.25, 0.3)
  Top 0.203: J1.3 5.16,12.28 v6.95,12.28 v6.96,12.28 6.96,18.85 9.96,21.84 v11.68,21.84 19.56,21.84 21.08,20.32 21.08,19.39 R3.1 | U1.2 11.2,14.78 10.46,15.52 v10.36,15.52 | J3.8 20.32,1.78 16.26,5.84 11.94,5.84 11.18,6.6 11.18,7.7 v10.64,8.23
  Bottom 0.203: v10.36,15.52 10.26,15.62 9.12,15.62 8.87,15.88 8.87,19.43 11.28,21.84 v11.68,21.84 | v10.64,8.23 6.95,11.92 v6.95,12.28
TIMEPULSE  (via drill 0.2)
  Top 0.203: U1.33 v11.31,14.1 v11.3,14.1
  Bottom 0.203: v11.3,14.1 11.25,14.05 8.53,14.05 8.08,14.5 8.08,19.76 12.45,24.13 J5.3
TXO/MISO  (via drill 0.3)
  Top 0.203: v12.72,9.45 12.7,9.47 U1.21
  Bottom 0.203: v12.72,9.45 12.55,9.63 11.4,9.63 11.2,9.42 11.2,4.09 10.67,3.56 7.37,3.56 J3.2
V_BATT
  Top 0.254: U1.16 14.76,11.26 15.63,11.26 15.89,11.51 16.99,11.51 | R1.1 16.99,11.51 | 16.99,11.51 16.99,9.78 17.63,9.14 19.95,9.14 B1.+

### Text on the board
Bottom: v10
tPlace: - | +
Measures: Units in Inches
tDocu: Elias Santistevan | 0.8mm Board Thickness